# EAGLE design micro_transponder (EAGLE 9.0.1)
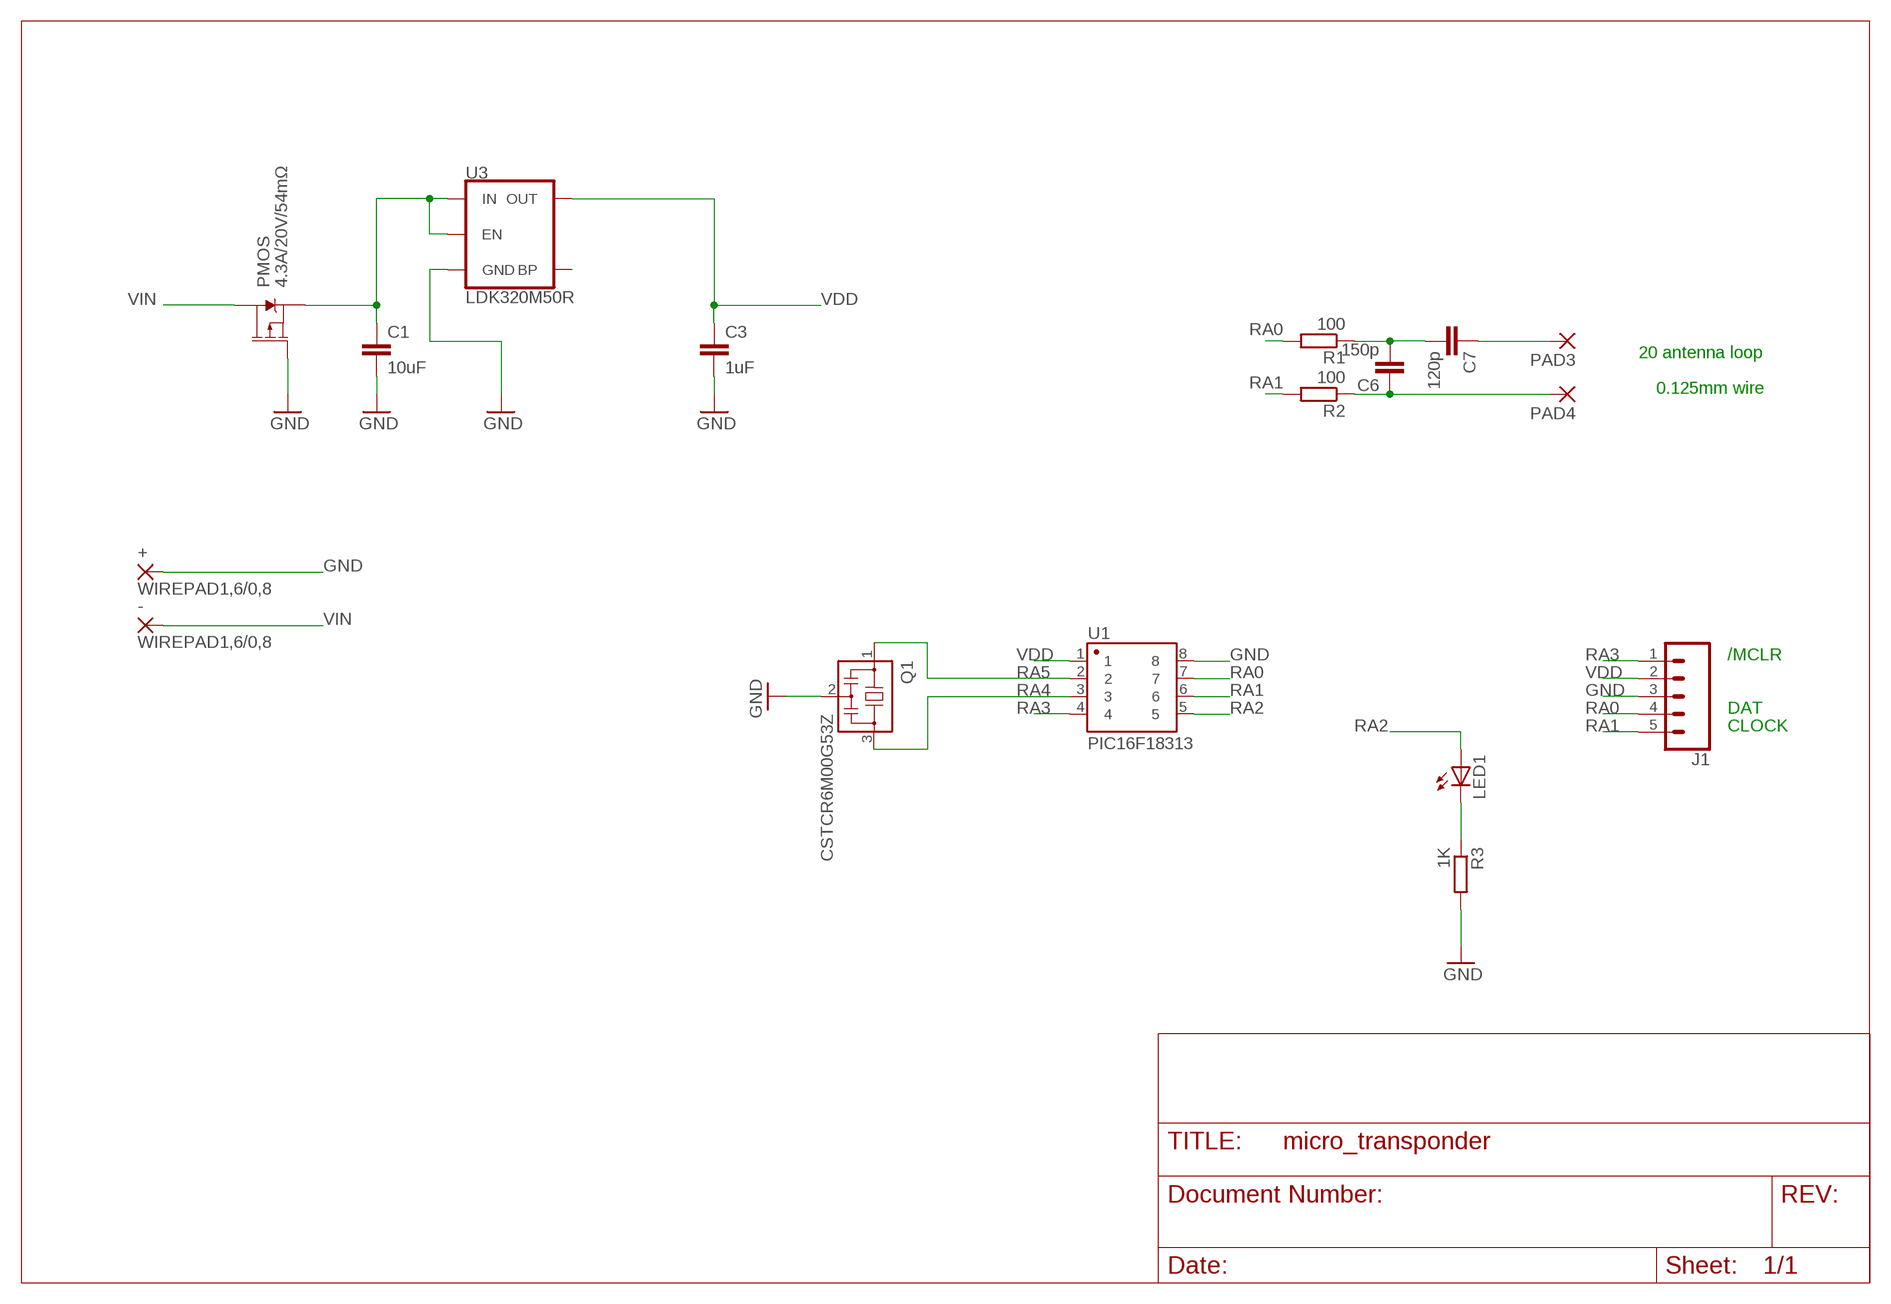
[diagram p0: schematic, sheet 1]

## Parts
+  WIREPAD1,6/0,8  [1,6/0,8]
-  WIREPAD1,6/0,8  [1,6/0,8]
C1  10uF  C-EUC0805  [C0805]
C3  1uF  C-EUC0603  [C0603]
C6  150p  C-EUC0603  [C0603]
C7  120p  C-EUC0603  [C0603]
J1  CONN_051.27MM  [1X05_1.27MM]
LED1  LEDCHIP-LED0805  [CHIP-LED0805]
PAD3  1,6/0,9  [1,6/0,9]
PAD4  1,6/0,9  [1,6/0,9]
PMOS  4.3A/20V/54mΩ  MOSFET_PCH-IRLML2244  [SOT23-3]
Q1  CSTCR6M00G53Z  [CSTCR6M]
R1  100  R-EU_R0603  [R0603]
R2  100  R-EU_R0603  [R0603]
R3  1K  R-EU_R0603  [R0603]
U1  PIC16F18313  [SOIC8]
U3  LDK320M50R  V_REG_MIC52055V  [SOT23-5]

## Nets
GND: +.1(P) C1.2 C3.2 J1.3 PMOS.1(G) Q1.2 R3.2 U1.8 U3.2(GND)
N$1: C1.1 PMOS.2(S) U3.1(IN) U3.3(EN)
N$2: C6.2 C7.2 R1.1
N$3: C6.1 PAD4.1(P) R2.1
N$5: LED1.C R3.1
N$6: C7.1 PAD3.1(P)
RA0: J1.4 R1.2 U1.7
RA1: J1.5 R2.2 U1.6
RA2: LED1.A U1.5
RA3: J1.1 U1.4
RA4: Q1.3 U1.3
RA5: Q1.1 U1.2
VDD: C3.1 J1.2 U1.1 U3.5(OUT)
VIN: -.1(P) PMOS.3(D)
Unconnected: U3.4(BP)

## Notes on the sheet
- 20 antenna loop
- 0.125mm wire
- /MCLR
- DAT
- CLOCK

## Library data of the parts
+ - = wirepad:WIREPAD: Wire PAD connect wire on PCB
C1 C3 C6 C7 = rcl:C-EU: CAPACITOR, European symbol; SPICEPREFIX: C
J1 = SparkFun-Connectors:CONN_05: Multi connection point. Often used as Generic Header-pin footprint for 0.1 inch spaced/style header connections On any of the 0.1 inch spaced packages, you can populate with these: Break Away Headers - Straight <https://www.sparkfun.com/products/116> (PRT-00116) Break Away Male Headers - Right Angle <https://www.sparkfun.com/products/553> (PRT-00553) Female Headers <https://www.sparkfun.com/products/115> (PRT-00115) Break Away Headers - Machine Pin <https://www.sparkfun.com/products/117> (PRT-00117) Break Away Female Headers - Swiss Machine Pin <https://www.sparkfun.com/products/743> (PRT-00743) For SCREWTERMINALS and SPRING TERMINALS visit here: Screw Terimnals on SparkFun.com <https://www.sparkfun.com/search/results?term=Screw+Terminals> (5mm/3.5mm/2.54mm spacing) This device is also useful as a general connection point to wire up your design to another part of your project. Our various solder wires solder well into these plated through hole pads. Hook-Up Wire - Assortment (Stranded, 22 AWG) <https://www.sparkfun.com/products/11375> (PRT-11375) Hook-Up Wire - Assortment (Solid Core, 22 AWG) <https://www.sparkfun.com/products/11367> (PRT-11367) View the entire wire category on our website here <https://www.sparkfun.com/categories/141> Special notes: Molex polarized connector foot print use with SKU : PRT-08231 with associated crimp pins and housings. 1MM SMD Version SKU: PRT-10208
LED1 = led:LED: LED OSRAM: - CHIPLED LG R971, LG N971, LY N971, LG Q971, LY Q971, LO R971, LY R971 LH N974, LH R974 LS Q976, LO Q976, LY Q976 LO Q996 - Hyper CHIPLED LW Q18S LB Q993, LB Q99A, LB R99A - SideLED LS A670, LO A670, LY A670, LG A670, LP A670 LB A673, LV A673, LT A673, LW A673 LH A674 LY A675 LS A676, LA A676, LO A676, LY A676, LW A676 LS A679, LY A679, LG A679 - Hyper Micro SIDELED® LS Y876, LA Y876, LO Y876, LY Y876 LT Y87S - SmartLED LW L88C, LW L88S LB L89C, LB L89S, LG L890 LS L89K, LO L89K, LY L89K LS L896, LA L896, LO L896, LY L896 - TOPLED LS T670, LO T670, LY T670, LG T670, LP T670 LSG T670, LSP T670, LSY T670, LOP T670, LYG T670 LG T671, LOG T671, LSG T671 LB T673, LV T673, LT T673, LW T673 LH T674 LS T676, LA T676, LO T676, LY T676, LB T676, LH T676, LSB T676, LW T676 LB T67C, LV T67C, LT T67C, LS T67K, LO T67K, LY T67K, LW E67C LS E67B, LA E67B, LO E67B, LY E67B, LB E67C, LV E67C, LT E67C LW T67C LS T679, LY T679, LG T679 LS T770, LO T770, LY T770, LG T770, LP T770 LB T773, LV T773, LT T773, LW T773 LH T774 LS E675, LA E675, LY E675, LS T675 LS T776, LA T776, LO T776, LY T776, LB T776 LHGB T686 LT T68C, LB T68C - Hyper Mini TOPLED® LB M676 - Mini TOPLED Santana® LG M470 LS M47K, LO M47K, LY M47K Source: http://www.osram.convergy.de LUXEON: - LUMILED® LXK2-PW12-R00, LXK2-PW12-S00, LXK2-PW14-U00, LXK2-PW14-V00 LXK2-PM12-R00, LXK2-PM12-S00, LXK2-PM14-U00 LXK2-PE12-Q00, LXK2-PE12-R00, LXK2-PE12-S00, LXK2-PE14-T00, LXK2-PE14-U00 LXK2-PB12-K00, LXK2-PB12-L00, LXK2-PB12-M00, LXK2-PB14-N00, LXK2-PB14-P00, LXK2-PB14-Q00 LXK2-PR12-L00, LXK2-PR12-M00, LXK2-PR14-Q00, LXK2-PR14-R00 LXK2-PD12-Q00, LXK2-PD12-R00, LXK2-PD12-S00 LXK2-PH12-R00, LXK2-PH12-S00 LXK2-PL12-P00, LXK2-PL12-Q00, LXK2-PL12-R00 Source: www.luxeon.com KINGBRIGHT: KA-3528ASYC Source: www.kingbright.com
PAD3 PAD4 = wirepad:1,6/0,9: THROUGH-HOLE PAD
PMOS = SparkFun-DiscreteSemi:MOSFET_PCH: P-channel MOSFETs Voltage controlled devices that allow control of high current outputs. SparkFun Products: SparkFun ESP32 Thing <https://www.sparkfun.com/products/13907> SparkFun ESP8266 Thing <https://www.sparkfun.com/products/13231>; PROD_ID: TRANS-11153
Q1 = murata-filter:CSTCR: Resonator Source: murata.co.jp; MPN: CSTCR6M00G53-R0; OC_FARNELL: 1170434; OC_NEWARK: 25M8759
R1-R3 = rcl:R-EU_: RESISTOR, European symbol; SPICEPREFIX: R
U1 = PIC16F18313:PIC16F18313
U3 = SparkFun-IC-Power:V_REG_MIC5205: V_REG MIC5205 Standard 3.3V, 5V, and Adjustable 150mA LDO voltage regulator in SOT-23 layout. Micrel part MIC5205. BP (by-pass) pin is used to lower output noise with 470pF cap, may be left open. On the adjustable version BP is used to set output.; PROD_ID: VREG-00823; VALUE: 5V

## Board
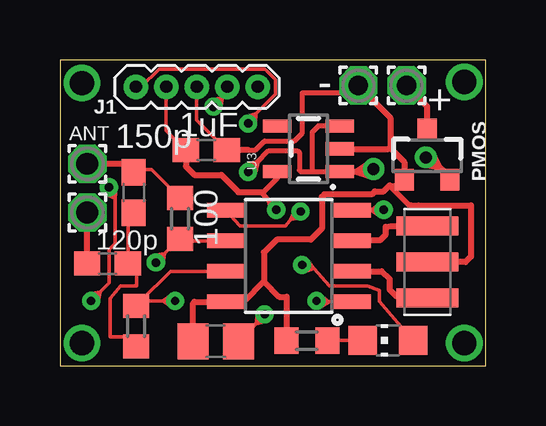
[diagram p1: board, top side]
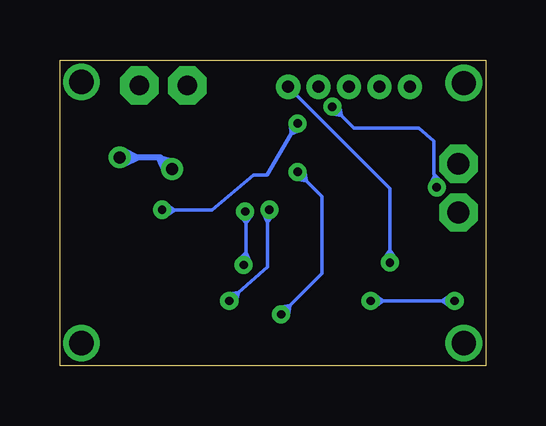
[diagram p2: board, bottom side, seen from below]

Size 17.76 x 12.75 mm. Coordinates in mm from the lower left corner, seen from the top.
Outline: 0,0 17.76,0 17.76,12.75 0,12.75 0,0
Copper layers (1*16): Top 0.035mm / dielectric 1.5mm / Bottom 0.035mm
Design rules "default *": minimum track width 6mil, minimum drill 0.35mm, track to track 8mil, track to pad 6mil, pad to pad 6mil, via to via 6mil, smd to smd 6mil, copper to edge 10mil, drill to drill 6mil, minimum pad ring 10mil, minimum via ring 8mil, stop-mask expansion 4mil, vias tented up to drill 0mil, thermal gap 10mil

### Footprints (pad centres in the part's own frame; a part is rotated, then mirrored left to right if it is on the bottom)
1,6/0,8 = drill 0.813 pad 1.6 octagon: 1 0,0
C0805 = smd 1.3 x 1.5: 1 -0.95,0; 2 0.95,0
C0603 = smd 1.1 x 1: 1 -0.85,0; 2 0.85,0
1X05_1.27MM = drill 0.508 pad 1: 1 0,0; 2 1.27,0; 3 2.54,0; 4 3.81,0; 5 5.08,0
CHIP-LED0805 = smd 1.2 x 1.2: A 0,-1.05; C 0,1.05
1,6/0,9 = drill 0.914 pad 1.6 octagon: 1 0,0
SOT23-3 = smd 0.8 x 0.9: 1 -0.95,-1; 2 0.95,-1; 3 0,1.1
CSTCR6M = smd 0.8 x 2.6: 1 -1.5,0; 2 0,0; 3 1.5,0
R0603 = smd 1 x 1.1: 1 -0.85,0; 2 0.85,0
SOIC8 = smd 0.6 x 1.6: 1 -1.905,-2.616; 2 -0.635,-2.616; 3 0.635,-2.616; 4 1.905,-2.616; 5 1.905,2.616; 6 0.635,2.616; 7 -0.635,2.616; 8 -1.905,2.616
SOT23-5 = smd 0.55 x 1.2: 1 -0.95,-1.3; 2 0,-1.3; 3 0.95,-1.3; 4 0.95,1.3; 5 -0.95,1.3

### Placement (x,y rotation side)
+  12.45,11.68 0 top
-  14.45,11.68 0 top
C1  6.5,1.02 180 top
C3  6.11,8.98 0 top
C6  3.08,7.22 270 top
C7  1.99,4.25 0 top
J1  3.17,11.63 0 top
LED1  13.68,1.05 90 top
PAD3  1.14,6.38 0 top
PAD4  1.14,8.42 0 top
PMOS  15.31,8.75 0 top
Q1  15.32,4.32 90 top
R1  3.17,1.65 90 top
R2  5.01,6.13 270 top
R3  10.3,1.04 180 top
U1  9.54,4.57 90 top
U3  10.36,9.04 90 top

### Tracks (layer width: path | path; a pad name or v marks a point on that pad's centre or on a via)
GND
  Top 0.152: 7.26,2.8 U1.8 7.26,2.67 7.57,2.67 | 7.27,9.3 6.99,9.02 C3.2 5.71,10.23 J1.3
  Top 0.203: 13.7,9.04 13.78,9.12 | 7.67,8.99 8.15,8.99 8.53,9.37 9.78,9.37 10.11,9.7 10.11,11.38 12.14,11.38 +.1 | PMOS.1 14.13,7.51 13.75,7.51 14.58,6.68 14.96,6.68
  Top 0.254: 14.64,6.68 14.96,6.68 17.14,6.68 17.14,4.55 16.92,4.32 Q1.2 | +.1 13.78,10.35 13.78,9.12 13.75,9.09 14.36,8.48 PMOS.1 | 7.82,8.99 7.67,8.99 7.01,8.99 6.99,9.02 | 8.51,3.5 8.51,4.72 9.04,5.26 10.46,5.26 10.92,5.71 10.92,7.04 11.02,7.14 13.01,7.14 13.13,7.26 13.5,7.26 13.75,7.51 | 7.26,2.67 7.67,2.67 8.51,3.5 | 8.51,3.5 9.14,2.87 9.45,2.87 R3.2 | C1.2 5.55,2.61 5.61,2.67 U1.8 | U3.2 13.7,9.04
N$1  (via drill 0.35, 0.5)
  Top 0.152: 8.15,8.38 v7.85,8.08 | v8.54,2.14 8.18,1.75 | 8.18,1.75 7.54,1.03 C1.1 | 8.18,1.75 8.6,1.84 v8.54,2.14 | 8.18,1.75 8.23,2.17 v8.54,2.14
  Top 0.203: 11.91,10.03 U3.3 10.78,9.99 10.52,9.73 10.52,8.09 | v7.85,8.08 8.21,8.44 8.21,8.46 | 8.21,8.46 8.21,8.47 8.7,8.97 9.91,8.97 9.98,8.89 9.98,8.15 10.04,8.09 10.52,8.09 | 10.52,8.09 U3.1 11.7,8.13 | 12.97,8.09 v13.08,8.2 | 16.26,7.95 PMOS.2 | 8.21,8.46 7.78,8.35 v7.85,8.08 | 8.21,8.46 8.12,8.03 v7.85,8.08
  Top 0.254: U3.1 12.34,8.09 | 12.34,8.09 12.97,8.09 | v15.27,8.69 15.87,8.24 | 15.87,8.24 16.26,7.95 | 12.34,8.09 12.98,7.89 v13.08,8.2 12.9,8.47 12.34,8.09 | 15.87,8.24 15.55,8.84 v15.27,8.69 | 15.87,8.24 15.2,8.37 v15.27,8.69
  Bottom 0.152: v7.85,8.08 7.48,7.71 | 7.48,7.71 6.83,7.06 6.83,3.91 6.83,3.84 8.16,2.51 | 8.16,2.51 v8.54,2.14 | 7.48,7.71 7.9,7.78 v7.85,8.08 | 7.48,7.71 7.55,8.13 v7.85,8.08 | 8.16,2.51 8.24,2.08 v8.54,2.14 | 8.16,2.51 8.59,2.43 v8.54,2.14
  Bottom 0.254: v13.08,8.2 13.56,8.69 13.65,8.69 | 13.65,8.69 14.52,8.69 | 14.52,8.69 v15.27,8.69 | 13.65,8.69 13,8.52 v13.08,8.2 | 13.65,8.69 13.38,8.07 v13.08,8.2 | 14.52,8.69 15.12,8.39 v15.27,8.69 | 14.52,8.69 15.12,8.98 v15.27,8.69
N$2
  Top 0.152: C6.2 2.84,6.13 C7.2 3.2,3.89 3.2,3.33 2.53,3.33 2.1,2.8 2.1,1.2 2.78,1.2 R1.1
N$3
  Top 0.152: 2.73,8.42 2.97,8.17 | 2.97,8.17 C6.1 | R2.1 3.82,8.17 2.97,8.17
  Top 0.254: C6.1 2.73,8.42 PAD4.1
N$4  (via drill 1.02)
  other vias: 0.92,11.78
N$5
  Top 0.152: R3.1 LED1.C
N$6
  Top 0.152: C7.1
  Top 0.254: C7.1 PAD3.1
N$7  (via drill 1.02)
  other vias: 16.86,11.84
N$8  (via drill 1.02)
  other vias: 0.92,0.94
N$9  (via drill 1.02)
  other vias: 16.86,0.94
RA0  (via drill 0.35)
  Top 0.152: R1.2 3.37,2.7 | 3.37,2.7 4.61,3.94 U1.7 | 1.67,3.07 2.06,3.46 2.06,4.85 2.3,5.09 2.3,6.98 | 1.67,3.07 v1.3,2.7 | v4.8,2.7 4.28,2.7 | 4.28,2.7 3.37,2.7 | J1.4 6.98,11.38 6.77,11.17 | 6.77,11.17 v6.4,10.8 | v2.04,7.44 2.3,7.18 2.3,6.98 | 1.67,3.07 1.25,3 v1.3,2.7 | 1.67,3.07 1.6,2.65 v1.3,2.7 | 4.28,2.7 4.63,2.45 v4.8,2.7 | 4.28,2.7 4.63,2.95 v4.8,2.7 | 6.77,11.17 6.35,11.1 v6.4,10.8 | 6.77,11.17 6.7,10.75 v6.4,10.8 | 2.3,6.98 2.35,7.41 v2.04,7.44 | 2.3,6.98 1.91,7.16 v2.04,7.44
  Bottom 0.152: v1.3,2.7 1.82,2.7 | 1.82,2.7 4.28,2.7 | 4.28,2.7 v4.8,2.7 | v6.4,10.8 6.03,10.43 | 6.03,10.43 5.5,9.9 2.8,9.9 2.17,9.37 2.17,9.2 2.17,8.84 2.17,7.99 2.13,7.95 | 2.13,7.95 2.04,7.86 | 2.04,7.86 v2.04,7.44 | 1.82,2.7 1.47,2.95 v1.3,2.7 | 1.82,2.7 1.47,2.45 v1.3,2.7 | 4.28,2.7 4.63,2.45 v4.8,2.7 | 4.28,2.7 4.63,2.95 v4.8,2.7 | 6.03,10.43 6.45,10.5 v6.4,10.8 | 6.03,10.43 6.1,10.85 v6.4,10.8 | 2.04,7.86 1.83,7.65 v2.04,7.44 | 2.13,7.95 2.32,7.57 v2.04,7.44
RA1  (via drill 0.35)
  Top 0.152: U1.6 5.08,5.21 R2.2 4.98,5.28 4.37,4.67 | v4,4.3 4.37,4.67 | 4.37,4.67 3.95,4.6 v4,4.3 | 4.37,4.67 4.3,4.25 v4,4.3
  Bottom 0.152: J1.5 4,7.38 4,4.83 | 4,4.83 v4,4.3 | 4,4.83 3.75,4.47 v4,4.3 | 4,4.83 4.25,4.47 v4,4.3
RA2  (via drill 0.35)
  Top 0.152: LED1.A 13.32,2.67 13.32,3.14 12.82,3.33 11.24,3.33 10.6,4.05 | v10.1,4.2 10.47,4.2 10.6,4.05 | v10.03,6.43 9.91,6.45 9.4,5.82 7.51,5.82 U1.5 | 10.6,4.05 10.34,4.39 v10.1,4.2 | 10.6,4.05 10.2,3.91 v10.1,4.2 | v10.03,6.43 10.05,6.15 9.62,6.09 9.81,6.49 v10.03,6.43
  Bottom 0.152: v10.1,4.2 10,4.3 10,4.71 | v10.03,6.43 10,6.44 10,5.93 | 10,4.71 10,5.93 | 10,4.71 9.82,4.32 v10.1,4.2 | 10,4.71 10.31,4.42 v10.1,4.2 | 10,5.93 10.25,6.28 v10.03,6.43 | 10,5.93 9.76,6.28 v10.03,6.43
RA3  (via drill 0.35)
  Top 0.152: J1.1 3.4,11.63 4.13,12.37 8.55,12.37 8.98,11.94 8.98,11.32 8.17,10.51 | v7.85,10.1 7.85,10.19 8.17,10.51 | v13.5,6.5 12.97,6.5 | 12.97,6.5 12.18,6.5 U1.4 | 8.17,10.51 7.76,10.39 v7.85,10.1 | 8.17,10.51 8.15,10.09 v7.85,10.1 | 12.97,6.5 13.33,6.25 v13.5,6.5 | 12.97,6.5 13.33,6.75 v13.5,6.5
  Bottom 0.152: v7.85,10.1 8.12,9.65 | 8.12,9.65 9.13,7.95 9.69,7.95 11.42,6.5 12.97,6.5 | 12.97,6.5 v13.5,6.5 | 8.12,9.65 8.15,10.08 v7.85,10.1 | 8.12,9.65 7.73,9.82 v7.85,10.1 | 12.97,6.5 13.33,6.25 v13.5,6.5 | 12.97,6.5 13.33,6.75 v13.5,6.5
RA4
  Top 0.254: U1.3 12.19,5.23 13.36,5.23 13.59,5.46 13.59,5.79 13.8,5.82 Q1.3
RA5
  Top 0.152: 14.24,2.9 Q1.1
  Top 0.254: U1.2 13.41,3.94 13.74,3.61 13.74,3.17 14.02,2.9 14.24,2.9
VDD  (via drill 0.35)
  Top 0.152: C3.1 4.44,9.8 J1.2 | v10.7,2.7 10.73,2.67 11.22,2.67 | 11.22,2.67 U1.1 | 11.22,2.67 10.89,2.94 v10.7,2.7 | 11.22,2.67 10.86,2.44 v10.7,2.7
  Top 0.203: U3.5 9.06,7.82 8.48,7.24 8.48,7.12 8.73,6.87 | 8.73,6.87 v9.02,6.5 | 8.73,6.87 8.83,6.44 v9.02,6.5 | 8.73,6.87 9.16,6.69 v9.02,6.5
  Top 0.254: C3.1 5.25,8.31 5.61,7.95 6.73,7.95 7.44,7.24 8.48,7.24 | 9.32,8.07 U3.5
  Bottom 0.152: v9.02,6.5 9.1,5.97 | 9.1,5.97 9.1,4.12 10.31,3.05 | 10.31,3.05 v10.7,2.7 | 9.1,5.97 9.27,6.35 v9.02,6.5 | 9.1,5.97 8.85,6.33 v9.02,6.5 | 10.31,3.05 10.41,2.63 v10.7,2.7 | 10.31,3.05 10.73,3 v10.7,2.7
VIN
  Top 0.254: -.1 15.31,10.82 PMOS.3

### Text on the board
tNames: ANT